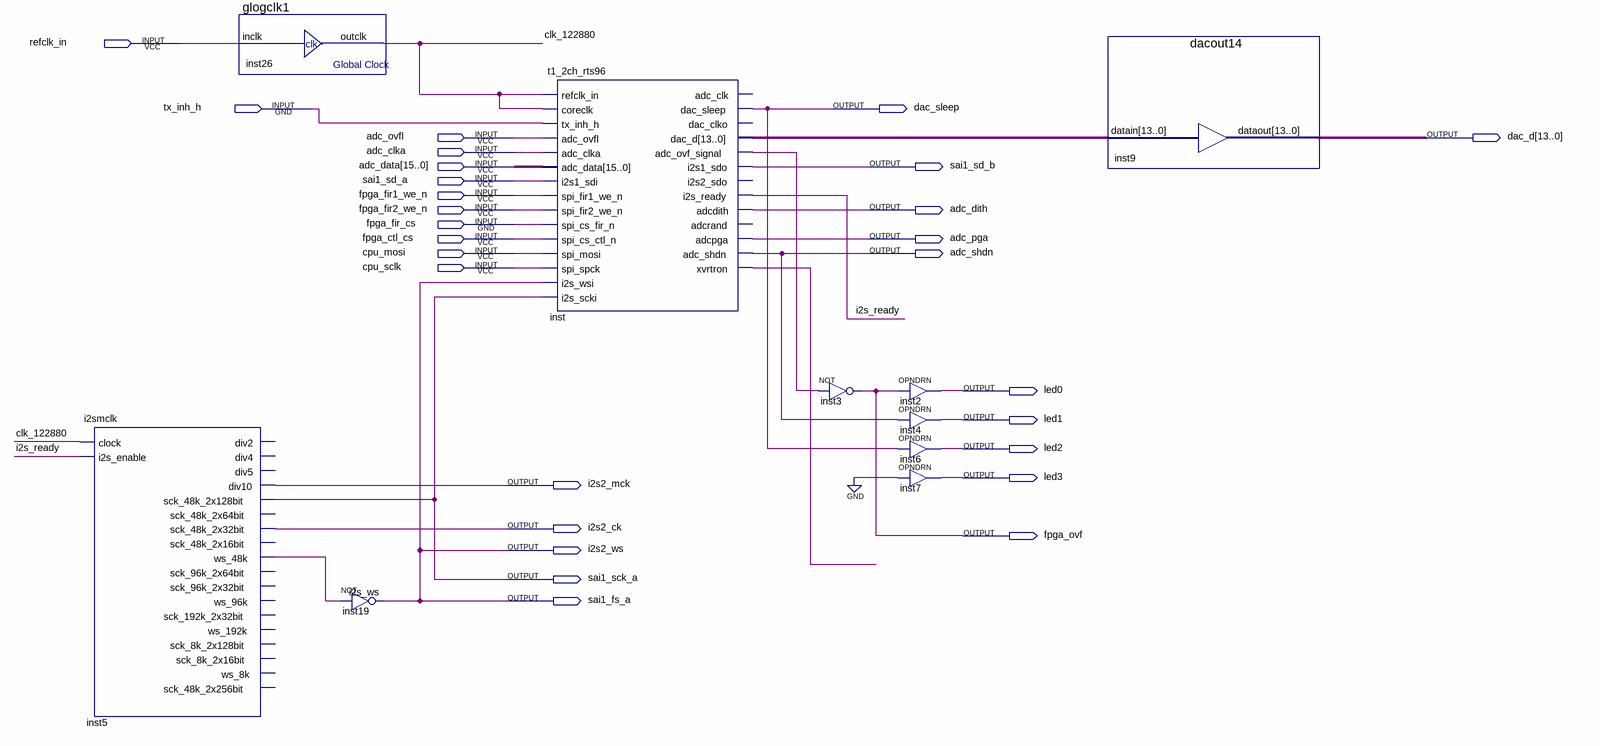
[diagram p0: schematic sheet]
// Quartus schematic tc1_top_v9a_2ch.bdf as structural Verilog: 10 symbols, 28 pins
module tc1_top_v9a_2ch (
  input  refclk_in,
  input  tx_inh_h,
  input  adc_ovfl,
  input  adc_clka,
  input  [15:0] adc_data,
  input  sai1_sd_a,
  input  fpga_fir1_we_n,
  input  fpga_fir2_we_n,
  input  fpga_fir_cs,
  input  fpga_ctl_cs,
  input  cpu_mosi,
  input  cpu_sclk,
  output dac_sleep,
  output [13:0] dac_d,
  output sai1_sd_b,
  output adc_dith,
  output adc_pga,
  output adc_shdn,
  output led0,
  output led1,
  output led2,
  output led3,
  output i2s2_mck,
  output i2s2_ck,
  output fpga_ovf,
  output i2s2_ws,
  output sai1_sck_a,
  output sai1_fs_a
);

  wire clk_122880, i2s_ready, inst5_ws_48k, inst_adc_ovf_signal, inst_xvrtron;
  wire [13:0] inst_dac_d;

  i2smclk inst5 (
    .clock(clk_122880), .i2s_enable(i2s_ready), .div10(i2s2_mck), .sck_48k_2x128bit(sai1_sck_a),
    .sck_48k_2x32bit(i2s2_ck), .ws_48k(inst5_ws_48k));  // open: div2, div4, div5, sck_48k_2x64bit, sck_48k_2x16bit, sck_96k_2x64bit, sck_96k_2x32bit, ws_96k, sck_192k_2x32bit, ws_192k, sck_8k_2x128bit, sck_8k_2x16bit, ws_8k, sck_48k_2x256bit
  glogclk1 inst26 (.inclk(refclk_in), .outclk(clk_122880));
  not inst19 (i2s2_ws, inst5_ws_48k);
  t1_2ch_rts96 inst (
    .refclk_in(clk_122880), .coreclk(clk_122880), .tx_inh_h(tx_inh_h), .adc_ovfl(adc_ovfl),
    .adc_clka(adc_clka), .adc_data(adc_data), .i2s1_sdi(sai1_sd_a), .spi_fir1_we_n(fpga_fir1_we_n),
    .spi_fir2_we_n(fpga_fir2_we_n), .spi_cs_fir_n(fpga_fir_cs), .spi_cs_ctl_n(fpga_ctl_cs),
    .spi_mosi(cpu_mosi), .spi_spck(cpu_sclk), .i2s_wsi(i2s2_ws), .i2s_scki(sai1_sck_a),
    .dac_sleep(dac_sleep), .dac_d(inst_dac_d), .adc_ovf_signal(inst_adc_ovf_signal), .i2s1_sdo(sai1_sd_b),
    .i2s_ready(i2s_ready), .adcdith(adc_dith), .adcpga(adc_pga), .adc_shdn(adc_shdn), .xvrtron(inst_xvrtron));  // open: adc_clk, dac_clko, i2s2_sdo, adcrand
  not inst3 (fpga_ovf, inst_adc_ovf_signal);
  OPNDRN inst2 (.IN(fpga_ovf), .OUT(led0));
  OPNDRN inst4 (.IN(adc_shdn), .OUT(led1));
  OPNDRN inst6 (.IN(dac_sleep), .OUT(led2));
  OPNDRN inst7 (.IN(1'b0), .OUT(led3));
  dacout14 inst9 (.datain(inst_dac_d), .dataout(dac_d));

  assign sai1_fs_a = i2s2_ws;

  // Other names for the same wires on the sheet: i2s_ws = i2s2_ws
endmodule
